# Altium schematic sheet Sheet_2.schdoc
size 316 x 158 mm
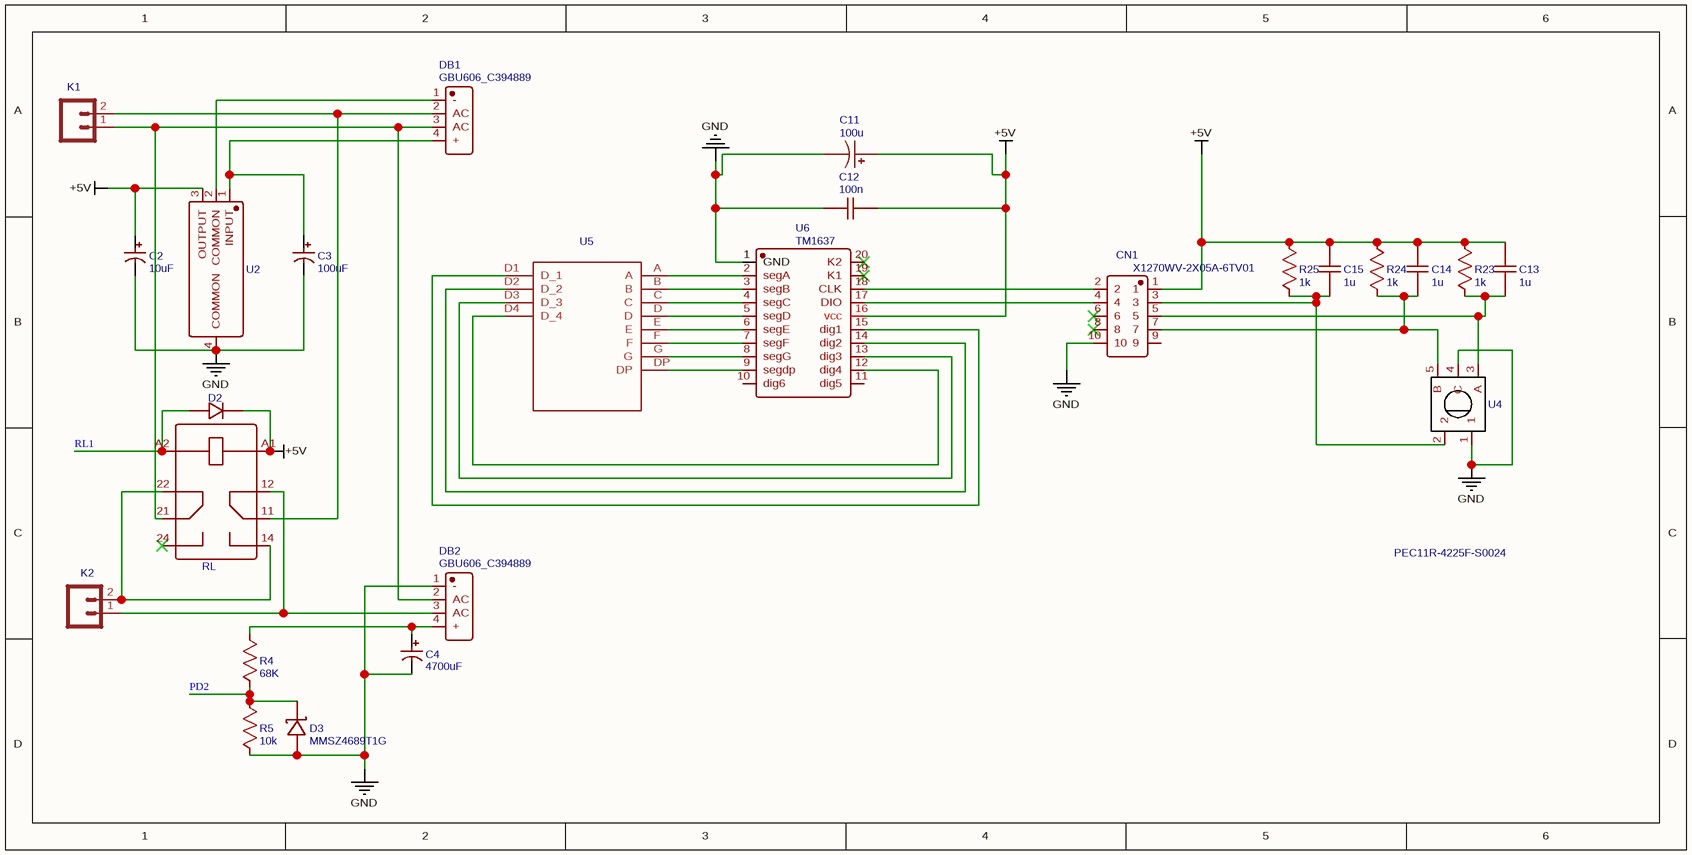
[diagram p0: Sheet_2.schdoc]

## Parts
C2  10uF  [CAP-TH_BD4.0-P1.50-D0.8-FD]
C3  100uF  [CAP-TH_BD5.0-P2.00-D0.8-FD]
C4  4700uF  [CAP-TH_BD22.0-P10.00-D2.3-FD]
C11  100u  [CAP-D3.0×F1.5]
C12  100n  [RAD-0.1]
C13  1u  [RAD-0.1]
C14  1u  [RAD-0.1]
C15  1u  [RAD-0.1]
CN1  X1270WV-2X05A-6TV01  [HDR-TH_10P-P1.27-V-F-R2-C5-S1.27]
D2  1N4007W  [SOD-123_L2.8-W1.8-LS3.7-RD]  (value not drawn)
D3  MMSZ4689T1G  [SOD-123_L2.8-W1.8-LS3.7-RD]
DB1  GBU606_C394889  [GBU_4P-L22.0-W3.5-P5.08]
DB2  GBU606_C394889  [GBU_4P-L22.0-W3.5-P5.08]
K1  M025MM  [SCREWTERMINAL-5MM-2]  (value not drawn)
K2  M025MM  [SCREWTERMINAL-5MM-2]  (value not drawn)
R4  68K  [R0805]
R5  10k  [R0805]
R23  1k  [R_AXIAL-0.4]
R24  1k  [R_AXIAL-0.4]
R25  1k  [R_AXIAL-0.4]
RL  RT424005F  [RELAY-TH_RT42XXX]  (value not drawn)
U2  TL780-05CKTTR  [TO-263-3_L8.6-W10.2-P2.54-LS14.4-TL]  (value not drawn)
U4  PEC11R-4225F-S0024  [PEC11R-4225F-S0024]
U5  4_DIGIT_7-SEGMENT_DISPLAYTHROUGH_HOLE  [4_DIGIT_7-SEGMENT_DISPLAY]  (value not drawn)
U6  TM1637  [TM1637]

## Nets
+5V: C2.1 C11.1 C12.2 C13.2 C14.2 C15.2 CN1.1 D2.1 R23.2 R24.2 R25.2 RL.A1 U2.3(OUTPUT) U6.16(vcc)
GND: C2.2 C3.2 C4.2 C11.2 C12.1 CN1.10 D3.2(A) DB2.1(-) R5.1 U2.4(COMMON) U4.1 U4.4(C) U6.1(GND)
PD2: D3.1(K) R4.1 R5.2
RL1: D2.2 RL.A2
NetC3_1: C3.1 DB1.4(+) U2.1(INPUT)
NetC4_1: C4.1 DB2.4(+) R4.2
NetC13_1: C13.1 CN1.5 R23.1 U4.3(A)
NetC14_1: C14.1 CN1.7 R24.1 U4.5(B)
NetC15_1: C15.1 CN1.3 R25.1 U4.2
NetCN1_2: CN1.2 U6.18(CLK)
NetCN1_4: CN1.4 U6.17(DIO)
NetDB1_1: DB1.1(-) U2.2(COMMON)
NetDB1_2: DB1.2(AC) K1.2 RL.11
NetDB1_3: DB1.3(AC) DB2.2(AC) K1.1 RL.21
NetDB2_3: DB2.3(AC) K2.1 RL.12
NetK2_2: K2.2 RL.14 RL.22
NetU5_A: U5.A U6.2(segA)
NetU5_B: U5.B U6.3(segB)
NetU5_C: U5.C U6.4(segC)
NetU5_D: U5.D U6.5(segD)
NetU5_D1: U5.D1(D_1) U6.15(dig1)
NetU5_D2: U5.D2(D_2) U6.14(dig2)
NetU5_D3: U5.D3(D_3) U6.13(dig3)
NetU5_D4: U5.D4(D_4) U6.12(dig4)
NetU5_DP: U5.DP U6.9(segdp)
NetU5_E: U5.E U6.6(segE)
NetU5_F: U5.F U6.7(segF)
NetU5_G: U5.G U6.8(segG)

Not connected (* = marked no-connect by the designer): CN1 6* 8* 9; RL 24*; U6 10(dig6) 11(dig5) 19(K1)* 20(K2)*

## Library data of the parts
C2 = 10uF: BOM_Manufacturer: Rubycon; BOM_Manufacturer Part: 25MS710MEFC4X7; nameAlias: Capacitance; BOM_Supplier: LCSC; BOM_Supplier Part: C88739; BOM_JLCPCB Part Class: Extended Part; spicePre: C; spiceSymbolName: 25MS710MEFC4X7
C3 = 100uF: BOM_Manufacturer: Rubycon; BOM_Manufacturer Part: 25YXJ100M5X11; nameAlias: Capacitance; BOM_Supplier: LCSC; BOM_Supplier Part: C108360; BOM_JLCPCB Part Class: Extended Part; spicePre: C; spiceSymbolName: 25YXJ100M5X11
C4 = 4700uF: BOM_Manufacturer: ValuePro; BOM_Manufacturer Part: 4700uF 50V 22*35; nameAlias: Capacitance; BOM_Supplier: LCSC; BOM_Supplier Part: C45662; BOM_JLCPCB Part Class: Extended Part; spicePre: C; spiceSymbolName: 4700uF 50V 22*35
C11 = 100u: nameAlias: Value(F); Contributor: LCEDA_Lib; spicePre: C; spiceSymbolName: CE_TH_D3.0×F1.5_US
C12 = 100n: nameAlias: Value(F); Contributor: LCEDA_Lib; spicePre: C; spiceSymbolName: C_RAD-0.1_US
C13-C15 = 1u: nameAlias: Value(F); Contributor: LCEDA_Lib; spicePre: C; spiceSymbolName: C_RAD-0.1_US
CN1 = X1270WV-2X05A-6TV01: BOM_Manufacturer: XKB Connectivity(中国星坤); Contributor: LCSC; BOM_Supplier: LCSC; BOM_Supplier Part: C2962228; BOM_Manufacturer Part: X1270WV-2x05A-6TV01; link: https://atta.szlcsc.com//upload/public/pdf/source/20220119/2B69FB5CD1159548117BE170C9531B28.pdf; spicePre: C; spiceSymbolName: X1270WV-2X05A-6TV01
D2 = 1N4007W: BOM_Manufacturer: BLUE ROCKET; Contributor: LCEDA_Lib; BOM_Supplier: LCSC; BOM_Supplier Part: C328592; BOM_Manufacturer Part: 1N4007W; spicePre: D; spiceSymbolName: 1N4007W
D3 = MMSZ4689T1G: BOM_Manufacturer: ON Semicon; Contributor: LCSC; BOM_Supplier: LCSC; BOM_Supplier Part: C236187; BOM_Manufacturer Part: MMSZ4689T1G; BOM_JLCPCB Part Class: Extended Part; spicePre: D; spiceSymbolName: MMSZ4689T1G
DB1 DB2 = GBU606_C394889: BOM_Manufacturer: Yangzhou Yangjie Elec Tech; BOM_Manufacturer Part: GBU606; Contributor: LCSC; BOM_Supplier: LCSC; BOM_Supplier Part: C394889; BOM_JLCPCB Part Class: Extended Part; spicePre: D; spiceSymbolName: GBU606_C394889
K1 K2 = M025MM: description: Standard 2-pin 0.1 header. Use with; Contributor: SparkFun; spicePre: J; spiceSymbolName: M025MM
R4 = 68K: nameAlias: Value(Ω); Contributor: LCEDA_Lib; spicePre: R; spiceSymbolName: R_0805_US
R5 = 10k: nameAlias: Value(Ω); Contributor: LCEDA_Lib; spicePre: R; spiceSymbolName: R_0805_US
R23-R25 = 1k: nameAlias: Value(Ω); Contributor: LCEDA_Lib; spicePre: R; spiceSymbolName: R_AXIAL-0.4_US
RL = RT424005F: BOM_Manufacturer: TE Connectivity(美国泰科); Contributor: LCSC; BOM_Supplier: LCSC; BOM_Supplier Part: C1563228; BOM_Manufacturer Part: RT424005F; spicePre: K; spiceSymbolName: RT424005F
U2 = TL780-05CKTTR: BOM_Manufacturer: Texas Instruments; Contributor: LCSC; BOM_Supplier: LCSC; BOM_Supplier Part: C485531; BOM_Manufacturer Part: TL780-05CKTTR; BOM_JLCPCB Part Class: Extended Part; spicePre: U; spiceSymbolName: TL780-05CKTTR
U4 = PEC11R-4225F-S0024: BOM_Manufacturer: Bourns; Contributor: Morgan Proffitt; BOM_Manufacturer Part: PEC11R-4225F-S0024; spicePre: U; spiceSymbolName: PEC11R-4225F-S0024
U5 = 4_DIGIT_7-SEGMENT_DISPLAYTHROUGH_HOLE: description: null; spicePre: U; spiceSymbolName: 4_DIGIT_7-SEGMENT_DISPLAYTHROUGH_HOLE
U6 = TM1637: Contributor: DanPo; spicePre: U; spiceSymbolName: TM1637